# Altium schematic sheet 1XGSH00_DIGITAL.SchDoc
size A4
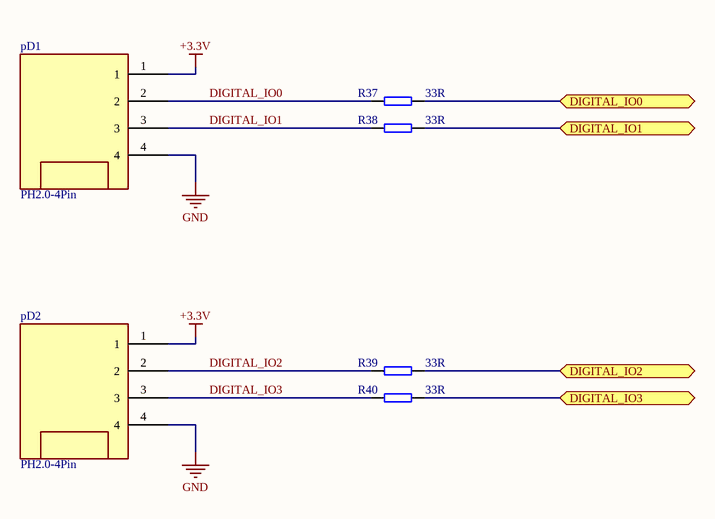
[diagram p0: 1XGSH00_DIGITAL.SchDoc]

## Parts
pD1  PH2.0-4Pin  [X1251WRS-04HF-LPSW]
pD2  PH2.0-4Pin  [X1251WRS-04HF-LPSW]
R37  33R  [0402_R]
R38  33R  [0402_R]
R39  33R  [0402_R]
R40  33R  [0402_R]

## Ports
DIGITAL_IO0 (bidir), DIGITAL_IO1 (bidir), DIGITAL_IO2 (bidir), DIGITAL_IO3 (bidir)

## Nets
+3.3V: pD1.1 pD2.1
GND: pD1.4 pD2.4
DIGITAL_IO0: pD1.2 R37.1
DIGITAL_IO0: R37.2 ; port DIGITAL_IO0  [a separate net that carries the same name]
DIGITAL_IO1: pD1.3 R38.1
DIGITAL_IO1: R38.2 ; port DIGITAL_IO1  [a separate net that carries the same name]
DIGITAL_IO2: pD2.2 R39.1
DIGITAL_IO2: R39.2 ; port DIGITAL_IO2  [a separate net that carries the same name]
DIGITAL_IO3: pD2.3 R40.1
DIGITAL_IO3: R40.2 ; port DIGITAL_IO3  [a separate net that carries the same name]

## Library data of the parts
R37-R40 = Resistor: Value: 1K